# Altium project linecarc20_balancing.PrjPcb
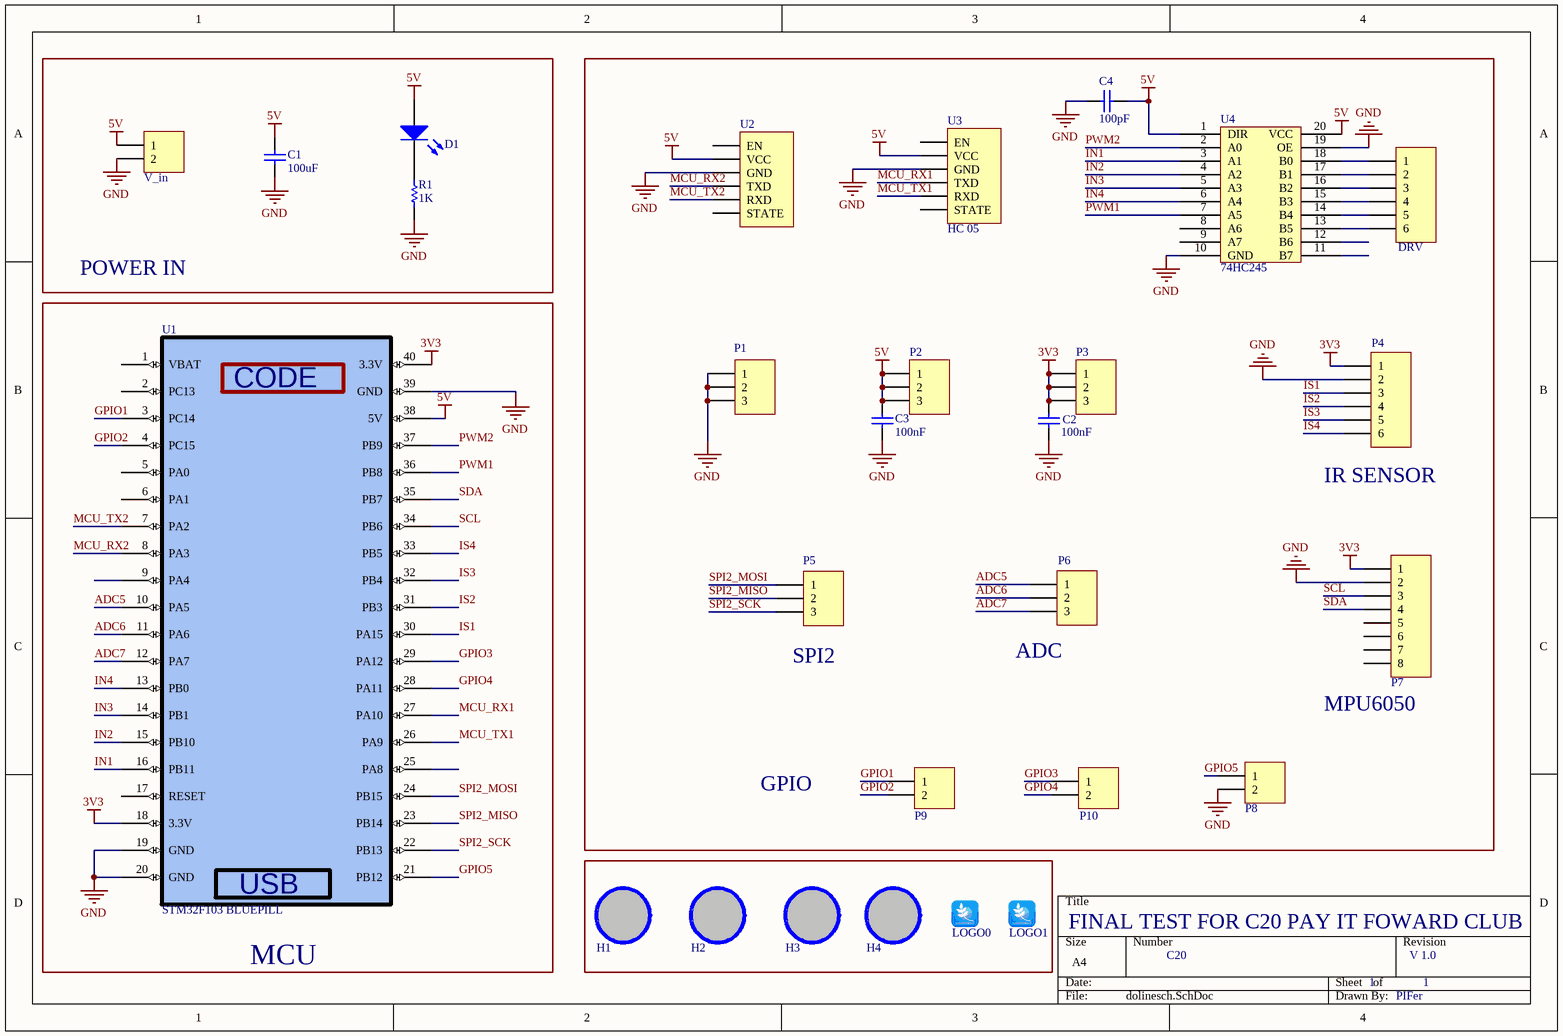
[diagram p0: dolinesch.SchDoc]
1 sheet, 28 parts. Net scope: global (net labels, ports and power ports of the same name join across sheets).
Board file: dolinepcb.PcbDoc

## Sheet dolinesch.SchDoc: LINE FOLLOWING ROBOT
size A4; Address1: PAY IT FOWARD CLUB; Address2: C20 FINAL TEST; Address3: PAGE 1/1; Time: 2:57:37 PM

### Parts
C1  value 100uF  [CAP-SM-0805]  (hidden comment: Cap Non-Pol SMD)
C2  value 100nF  [CAP-SM-0805]  (hidden comment: Cap Non-Pol SMD)
C3  value 100nF  [CAP-SM-0805]  (hidden comment: Cap Non-Pol SMD)
C4  value 100pF  [CAP-SM-0805]  (hidden comment: Cap Non-Pol SMD)
D1  LED  [LED-3mm]  (value not drawn)
DRV  Header 6  [JP6]  (value not drawn)
H1  Hole  [LO KHOAN 3MM]  (value not drawn)
H2  Hole  [LO KHOAN 3MM]  (value not drawn)
H3  Hole  [LO KHOAN 3MM]  (value not drawn)
H4  Hole  [LO KHOAN 3MM]  (value not drawn)
LOGO0  LOGO PIF  [PIF LOGO BOTTOM LAYER]  (value not drawn)
LOGO1  LOGO PIF  [PIF LOGO TOP OVERLAY]  (value not drawn)
P1  Header 3  [JP3]  (value not drawn)
P2  Header 3  [JP3]  (value not drawn)
P3  Header 3  [JP3]  (value not drawn)
P4  Header 6  [JP6]  (value not drawn)
P5  Header 3  [JP3]  (value not drawn)
P6  Header 3  [JP3]  (value not drawn)
P7  Header 8  [JP8]  (value not drawn)
P8  Header 2  [JP2]  (value not drawn)
P9  Header 2  [JP2]  (value not drawn)
P10  Header 2  [JP2]  (value not drawn)
R1  value 1K  [RES-SM-0603]  (hidden comment: RESISTOR SMD)
U1  STM32F103 BLUEPILL  [STM32F103 Bluepill]
U2  UART  [JP6]  (value not drawn)
U3  HC 05  [JP6]
U4  74HC245  [DIP20/W0.3]
V_in  Domino 2  [DOMINO 2- 5mm]  (value not drawn)

### Blocks framed on the sheet
POWER IN: C1 D1 R1 V_in
MCU: U1

### Nets
3V3: C2.2 P3.1 P3.2 P3.3 P4.1 P7.1 U1.18(3.3V) U1.40(3.3V)
5V: C1.2 C3.2 C4.2 D1.1(A) P2.1 P2.2 P2.3 U1.38(5V) U2.2(VCC) U3.2(VCC) U4.1(DIR) U4.20(VCC) V_in.1
GND: C1.1 C2.1 C3.1 C4.1 P1.1 P1.2 P1.3 P4.2 P7.2 P8.2 R1.2 U1.19(GND) U1.20(GND) U1.39(GND) U2.3(GND) U3.3(GND) U4.10(GND) U4.19(OE) V_in.2
ADC5: P6.1 U1.10(PA5)
ADC6: P6.2 U1.11(PA6)
ADC7: P6.3 U1.12(PA7)
GPIO1: P9.1 U1.3(PC14)
GPIO2: P9.2 U1.4(PC15)
GPIO3: P10.1 U1.29(PA12)
GPIO4: P10.2 U1.28(PA11)
GPIO5: P8.1 U1.21(PB12)
IN1: U1.16(PB11) U4.3(A1)
IN2: U1.15(PB10) U4.4(A2)
IN3: U1.14(PB1) U4.5(A3)
IN4: U1.13(PB0) U4.6(A4)
IS1: P4.3 U1.30(PA15)
IS2: P4.4 U1.31(PB3)
IS3: P4.5 U1.32(PB4)
IS4: P4.6 U1.33(PB5)
MCU_RX1: U1.27(PA10) U3.4(TXD)
MCU_RX2: U1.8(PA3) U2.4(TXD)
MCU_TX1: U1.26(PA9) U3.5(RXD)
MCU_TX2: U1.7(PA2) U2.5(RXD)
PWM1: U1.36(PB8) U4.7(A5)
PWM2: U1.37(PB9) U4.2(A0)
SCL: P7.3 U1.34(PB6)
SDA: P7.4 U1.35(PB7)
SPI2_MISO: P5.2 U1.23(PB14)
SPI2_MOSI: P5.1 U1.24(PB15)
SPI2_SCK: P5.3 U1.22(PB13)
NetD1_2: D1.2(K) R1.1
NetDRV_1: DRV.1 U4.18(B0)
NetDRV_2: DRV.2 U4.17(B1)
NetDRV_3: DRV.3 U4.16(B2)
NetDRV_4: DRV.4 U4.15(B3)
NetDRV_5: DRV.5 U4.14(B4)
NetDRV_6: DRV.6 U4.13(B5)

Not connected (* = marked no-connect by the designer): H1 1; H2 1; H3 1; H4 1; P7 5 6 7 8; U1 1(VBAT) 2(PC13) 5(PA0) 6(PA1) 9(PA4) 17(RESET) 25(PA8); U2 1(EN) 6(STATE); U3 1(EN) 6(STATE); U4 8(A6) 9(A7) 11(B7) 12(B6)

### Notes on the sheet
- (near P4) IR SENSOR
- (near P5) SPI2
- (near P6) ADC
- (near P7) MPU6050
- GPIO
- FINAL TEST FOR C20 PAY IT FOWARD CLUB
- C20
- 1
- V 1.0
- PIFer
- Title
- Size:
- Date:
- A4
- Number:
- Time:
- Revision:
- Sheet
- of
- File:
- (in symbol STM32F103 BLUEPILL) CODE; USB

### Library data of the parts
C1-C4 = Cap Non-Pol SMD: Capacitor
DRV P4 = Header 6: Header, 6-Pin; LatestRevisionDate: 17-Jul-2002; LatestRevisionNote: Re-released for DXP Platform.; Publisher: Altium Limited
H1-H4 = Hole: Hole 3mm
LOGO0 LOGO1 = LOGO PIF_2
P1-P3 P5 P6 = Header 3: Header, 3-Pin; LatestRevisionDate: 17-Jul-2002; LatestRevisionNote: Re-released for DXP Platform.; Publisher: Altium Limited
P7 = Header 8: Header, 8-Pin; LatestRevisionDate: 17-Jul-2002; LatestRevisionNote: Re-released for DXP Platform.; Publisher: Altium Limited
P8-P10 = Header 2: Header, 2-Pin; LatestRevisionDate: 17-Jul-2002; LatestRevisionNote: Re-released for DXP Platform.; Publisher: Altium Limited
R1 = RESISTOR SMD: Resistor
U2 = HC 05
U4 = 74HC245: Octal bus tranceiver
V_in = Domino 2: Domino, 2-Pin; LatestRevisionDate: 17-Jul-2002; LatestRevisionNote: Re-released for DXP Platform.; Publisher: Altium Limited